# EAGLE schematic STM32F413CG_WM8731 (EAGLE 9.2.0)

## Sheet 1 of 3
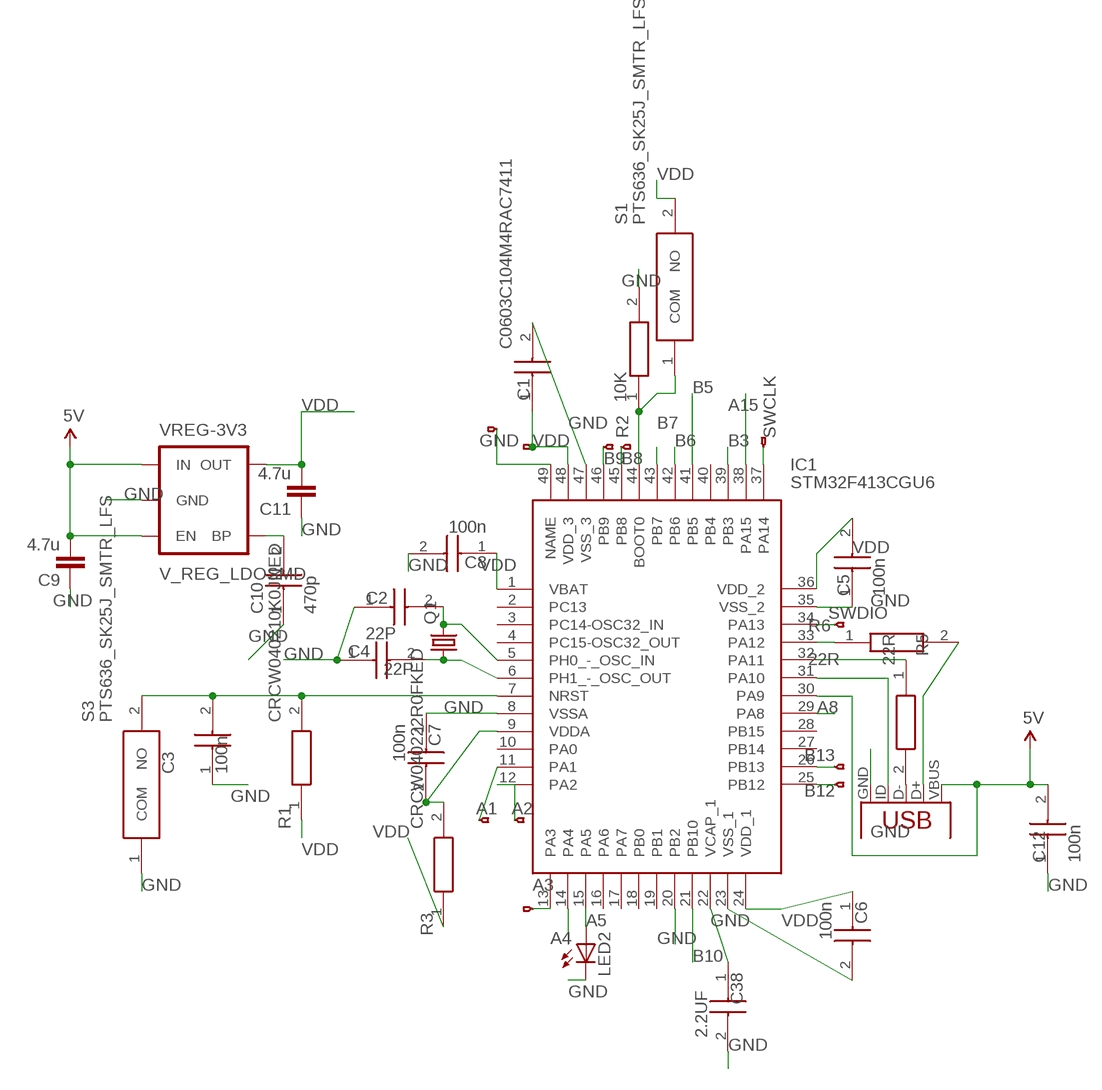
[diagram p0: schematic, sheet 1]

### Parts
C1  C0603C104M4RAC7411  [CAPC1608X95N]
C2  22P  C1608C0G1H150J080AA  [CAPC1608X80N]
C3  100n  C0603C104M4RAC7411  [CAPC1608X95N]
C4  22P  C1608C0G1H150J080AA  [CAPC1608X80N]
C5  100n  C0603C104M4RAC7411  [CAPC1608X95N]
C6  100n  C0603C104M4RAC7411  [CAPC1608X95N]
C7  100n  C0603C104M4RAC7411  [CAPC1608X95N]
C8  100n  C0603C104M4RAC7411  [CAPC1608X95N]
C9  4.7u  C2,5-3  [C2.5-3]
C10  470p  C0603C471K3RACTU  [CAPC1608X87N]
C11  4.7u  C2,5-3  [C2.5-3]
C12  100n  C0603C104M4RAC7411  [CAPC1608X95N]
C38  2.2UF  C2012X7R1E225K125AB  [CAPC2012X145N]
IC1  STM32F413CGU6  [QFN50P700X700X60-49N]
JP1  HEADERHOLE-HEADERHOLE  [1X1-HEADER-HOLE]
JP2  HEADERHOLE-HEADERHOLE  [1X1-HEADER-HOLE]
JP3  HEADERHOLE-HEADERHOLE  [1X1-HEADER-HOLE]
JP4  HEADERHOLE-HEADERHOLE  [1X1-HEADER-HOLE]
JP5  HEADERHOLE-HEADERHOLE  [1X1-HEADER-HOLE]
JP6  HEADERHOLE-HEADERHOLE  [1X1-HEADER-HOLE]
JP7  HEADERHOLE-HEADERHOLE  [1X1-HEADER-HOLE]
JP8  HEADERHOLE-HEADERHOLE  [1X1-HEADER-HOLE]
JP9  HEADERHOLE-HEADERHOLE  [1X1-HEADER-HOLE]
JP10  HEADERHOLE-HEADERHOLE  [1X1-HEADER-HOLE]
JP11  HEADERHOLE-HEADERHOLE  [1X1-HEADER-HOLE]
LED2  LED0603  [LED-0603]
Q1  CRYSTALHC49S  [HC49/S]
R1  CRCW040210K0JNED  [RESC1005X40N]
R2  10K  CRCW040210K0JNED  [RESC1005X40N]
R3  CRCW040222R0FKED  [RESC1005X40N]
R5  22R  CRCW040222R0FKED  [RESC1005X40N]
R6  22R  CRCW040222R0FKED  [RESC1005X40N]
S1  PTS636_SK25J_SMTR_LFS  [PTS636SK25JSMTRLFS]
S3  PTS636_SK25J_SMTR_LFS  [PTS636SK25JSMTRLFS]
VREG-3V3  V_REG_LDOSMD  [SOT23-5]
X1  USB-MICROB-SMD  [USB-MICROB-SMD]

### Nets
5V: C9.2 C12.2 IC1.30(PA9) VREG-3V3.1(IN) VREG-3V3.3(EN) X1.VBUS
A1: IC1.11(PA1) JP8.1
A2: IC1.12(PA2) JP9.1
A3: IC1.13(PA3) JP10.1
A4: IC1.14(PA4) ; also sheet 2
A5: IC1.15(PA5) LED2.A
A8: IC1.29(PA8) ; also sheet 2
A15: IC1.38(PA15) ; also sheet 3
B3: IC1.39(PB3) ; also sheet 3
B5: IC1.41(PB5) ; also sheet 3
B6: IC1.42(PB6) ; also sheet 3
B7: IC1.43(PB7) ; also sheet 3
B8: IC1.45(PB8) JP5.1
B9: IC1.46(PB9) JP11.1
B10: IC1.21(PB10) ; also sheet 3
B12: IC1.25(PB12) JP7.1
B13: IC1.26(PB13) JP6.1
GND: C1.2 C2.1 C3.1 C4.1 C5.1 C6.2 C7.1 C8.2 C9.1 C10.1 C11.1 C12.1 C38.2 IC1.8(VSSA) IC1.20(PB2) IC1.23(VSS_1) IC1.35(VSS_2) IC1.47(VSS_3) IC1.49(NAME) JP1.1 LED2.C R2.2 S3.1(COM) VREG-3V3.2(GND) X1.GND ; also sheet 2,3
N$1: C2.2 IC1.5(PH0_-_OSC_IN) Q1.2
N$3: C3.2 IC1.7(NRST) R1.2 S3.2(NO)
N$4: C10.2 VREG-3V3.4(BP)
N$5: C7.2 IC1.9(VDDA) R3.2
N$7: R5.2 X1.D-
N$8: IC1.31(PA10) X1.ID
N$9: IC1.32(PA11) R5.1
N$10: R6.2 X1.D+
N$11: IC1.33(PA12) R6.1
N$13: IC1.44(BOOT0) R2.1 S1.1(COM)
N$19: C4.2 IC1.6(PH1_-_OSC_OUT) Q1.1
N$48: C38.1 IC1.22(VCAP_1)
SWCLK: IC1.37(PA14) JP2.1
SWDIO: IC1.34(PA13) JP3.1
VDD: C1.1 C5.2 C6.1 C8.1 C11.2 IC1.1(VBAT) IC1.24(VDD_1) IC1.36(VDD_2) IC1.48(VDD_3) JP4.1 R1.1 R3.1 S1.2(NO) VREG-3V3.5(OUT) ; also sheet 2,3
Unconnected: IC1.2(PC13) IC1.3(PC14-OSC32_IN) IC1.4(PC15-OSC32_OUT) IC1.10(PA0) IC1.16(PA6) IC1.17(PA7) IC1.18(PB0) IC1.19(PB1) IC1.27(PB14) IC1.28(PB15) IC1.40(PB4) X1.MT1 X1.MT2 X1.MT3 X1.MT4

## Sheet 2 of 3
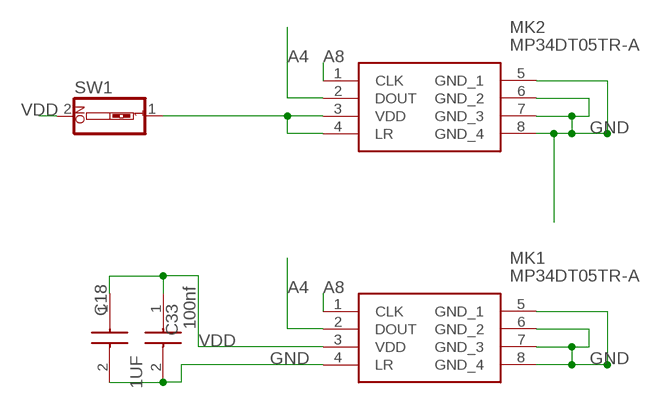
[diagram p1: schematic, sheet 2]

### Parts
C18  1UF  CC0402KRX5R6BB105  [CAPC1005X55N]
C33  100nf  C0603C104M4RAC7411  [CAPC1608X95N]
MK1  MP34DT05TR-A  [MP34DT05TRA]
MK2  MP34DT05TR-A  [MP34DT05TRA]
SW1  SW_DIP-1  [EDG-01]

### Nets
A4: MK1.2(DOUT) MK2.2(DOUT) ; also sheet 1
A8: MK1.1(CLK) MK2.1(CLK) ; also sheet 1
GND: C18.2(C2) C33.2 MK1.4(LR) MK1.5(GND_1) MK1.6(GND_2) MK1.7(GND_3) MK1.8(GND_4) MK2.5(GND_1) MK2.6(GND_2) MK2.7(GND_3) MK2.8(GND_4) ; also sheet 1,3
N$2: MK2.3(VDD) MK2.4(LR) SW1.1
VDD: C18.1(C1) C33.1 MK1.3(VDD) SW1.2 ; also sheet 1,3

## Sheet 3 of 3
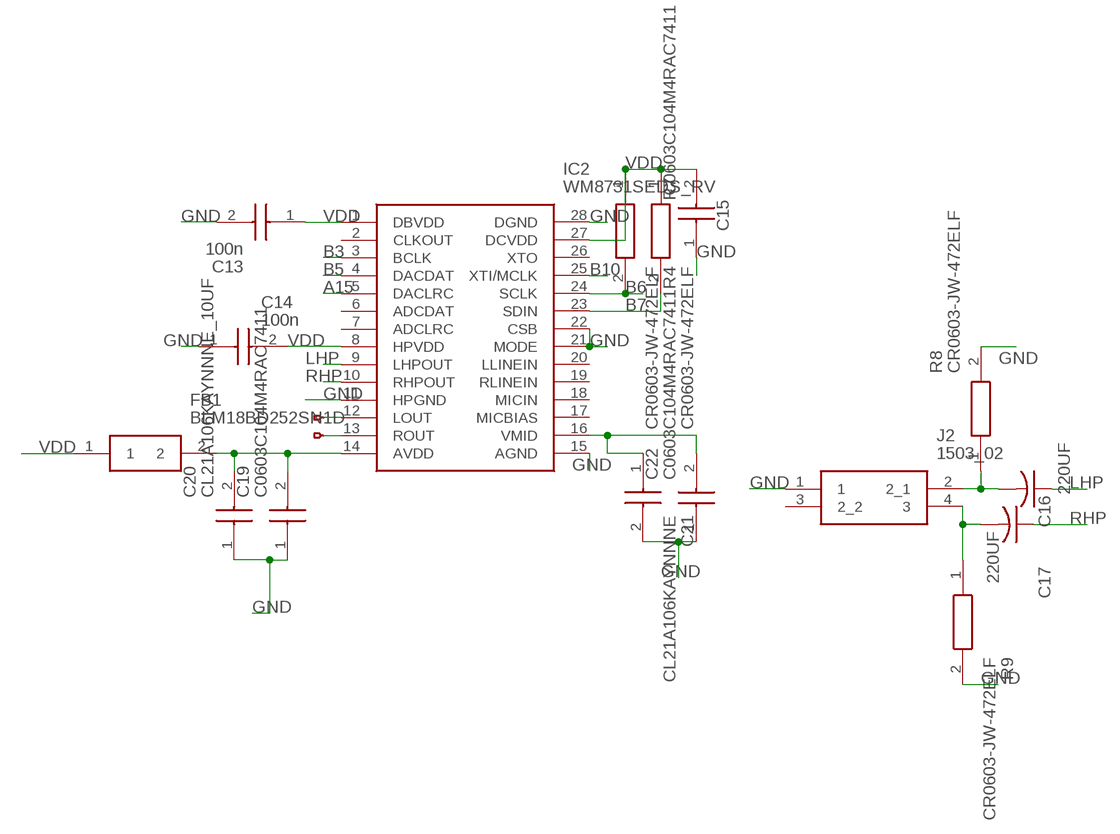
[diagram p2: schematic, sheet 3]

### Parts
C13  100n  C0603C104M4RAC7411  [CAPC1608X95N]
C14  100n  C0603C104M4RAC7411  [CAPC1608X95N]
C15  C0603C104M4RAC7411  [CAPC1608X95N]
C16  220UF  C-US025-024X044  [C025-024X044]
C17  220UF  C-US025-024X044  [C025-024X044]
C19  C0603C104M4RAC7411  [CAPC1608X95N]
C20  CL21A106KAYNNNE_10UF  CL21A106KAYNNNE  [CAPC2012X145N]
C21  CL21A106KAYNNNE  [CAPC2012X145N]
C22  C0603C104M4RAC7411  [CAPC1608X95N]
FB1  BLM18BD252SN1D  [BEADC1608X95N]
IC2  WM8731SEDS_RV  [SOP65P780X200-28N]
J2  1503_02  [150302]
JP12  HEADERHOLE-HEADERHOLE  [1X1-HEADER-HOLE]
JP13  HEADERHOLE-HEADERHOLE  [1X1-HEADER-HOLE]
R4  CR0603-JW-472ELF  [RESC1608X55N]
R7  CR0603-JW-472ELF  [RESC1608X55N]
R8  CR0603-JW-472ELF  [RESC1608X55N]
R9  CR0603-JW-472ELF  [RESC1608X55N]

### Nets
A15: IC2.5(DACLRC) ; also sheet 1
B3: IC2.3(BCLK) ; also sheet 1
B5: IC2.4(DACDAT) ; also sheet 1
B6: IC2.24(SCLK) R4.2 ; also sheet 1
B7: IC2.23(SDIN) R7.2 ; also sheet 1
B10: IC2.25(XTI/MCLK) ; also sheet 1
GND: C13.2 C14.1 C15.1 C19.1 C20.1 C21.2 C22.1 IC2.11(HPGND) IC2.15(AGND) IC2.21(MODE) IC2.22(CSB) IC2.28(DGND) J2.1 R8.2 R9.2 ; also sheet 1,2
LHP: C16.1 IC2.9(LHPOUT)
N$6: C16.2 J2.2(2_1) R8.1
N$12: C19.2 C20.2 FB1.2 IC2.14(AVDD)
N$14: C21.1 C22.2 IC2.16(VMID)
N$15: IC2.12(LOUT) JP13.1
N$16: IC2.13(ROUT) JP12.1
N$25: C17.2 J2.4 R9.1
RHP: C17.1 IC2.10(RHPOUT)
VDD: C13.1 C14.2 C15.2 FB1.1 IC2.1(DBVDD) IC2.8(HPVDD) IC2.27(DCVDD) R4.1 R7.1 ; also sheet 1,2
Unconnected: IC2.2(CLKOUT) IC2.6(ADCDAT) IC2.7(ADCLRC) IC2.17(MICBIAS) IC2.18(MICIN) IC2.19(RLINEIN) IC2.20(LLINEIN) IC2.26(XTO) J2.3(2_2)

## Library data of the parts
C1 C3 C5-C8 C12-C15 C33 = C0603C104M4RAC7411:C0603C104M4RAC7411: KEMET - C0603C104M4RAC7411 - CAP, 0.1F, 16V, 20%, X7R, 0603 Source: Datasheet <https://www.mouser.com/datasheet/2/212/KEM_C1023_X7R_AUTO_SMD-1093309.pdf>; DESCRIPTION: KEMET - C0603C104M4RAC7411 - CAP, 0.1F, 16V, 20%, X7R, 0603; HEIGHT: 0.95mm; MANUFACTURER_NAME: Kemet; MANUFACTURER_PART_NUMBER: C0603C104M4RAC7411; MOUSER_PART_NUMBER: 80-C0603C104M4R7411; MOUSER_PRICE-STOCK: https://www.mouser.com/Search/Refine.aspx?Keyword=80-C0603C104M4R7411
C2 C4 = C1608C0G1H150J080AA_15pF:C1608C0G1H150J080AA: TDK 0603 C 15pF Ceramic Multilayer Capacitor, 50 V dc, +125C, C0G Dielectric, +/-5% SMD Source: Datasheet <https://product.tdk.com/info/en/catalog/datasheets/mlcc_commercial_midvoltage_en.pdf>; DESCRIPTION: TDK 0603 C 15pF Ceramic Multilayer Capacitor, 50 V dc, +125C, C0G Dielectric, +/-5% SMD; HEIGHT: 0.8mm; MANUFACTURER_NAME: TDK; MANUFACTURER_PART_NUMBER: C1608C0G1H150J080AA; MOUSER_PART_NUMBER: 810-C1608C0G1H150J; MOUSER_PRICE-STOCK: https://www.mouser.com/Search/Refine.aspx?Keyword=810-C1608C0G1H150J; RS_PART_NUMBER: 7882935; RS_PRICE-STOCK: https://uk.rs-online.com/web/p/products/7882935
C9 C11 = capacitor-wima:C: CAPACITOR naming: grid - package width
C10 = C0603C471K3RACTU_470pF:C0603C471K3RACTU: KEMET - C0603C471K3RACTU - CAP, X7R, 470PF, 25V, 0603 Source: Datasheet <https://api.kemet.com/component-edge/download/specsheet/C0603C471K3RACTU.pdf>; DESCRIPTION: KEMET - C0603C471K3RACTU - CAP, X7R, 470PF, 25V, 0603; HEIGHT: 0.87mm; MANUFACTURER_NAME: Kemet; MANUFACTURER_PART_NUMBER: C0603C471K3RACTU; MOUSER_PART_NUMBER: 80-C0603C471K3R; MOUSER_PRICE-STOCK: https://www.mouser.com/Search/Refine.aspx?Keyword=80-C0603C471K3R
C16 C17 = rcl:C-US: CAPACITOR, American symbol; SPICEPREFIX: C
C18 = CC0402KRX5R6BB105_1UF:CC0402KRX5R6BB105: CAPACITOR, 0402 1uF +/-10% 10V Source: Datasheet <http://componentsearchengine.com/Datasheets/1/CC0402KRX5R6BB105.pdf>; DESCRIPTION: CAPACITOR, 0402 1uF +/-10% 10V; HEIGHT: mm; MANUFACTURER_NAME: YAGEO (PHYCOMP); MANUFACTURER_PART_NUMBER: CC0402KRX5R6BB105; MOUSER_PART_NUMBER: 603-CC402KRX5R6BB105; MOUSER_PRICE-STOCK: https://www.mouser.com/Search/Refine.aspx?Keyword=603-CC402KRX5R6BB105
C19 C22 = C0603C104M4RAC7411_100nF:C0603C104M4RAC7411: KEMET - C0603C104M4RAC7411 - CAP, 0.1F, 16V, 20%, X7R, 0603 Source: Datasheet <https://www.mouser.com/datasheet/2/212/KEM_C1023_X7R_AUTO_SMD-1093309.pdf>; DESCRIPTION: KEMET - C0603C104M4RAC7411 - CAP, 0.1F, 16V, 20%, X7R, 0603; HEIGHT: 0.95mm; MANUFACTURER_NAME: Kemet; MANUFACTURER_PART_NUMBER: C0603C104M4RAC7411; MOUSER_PART_NUMBER: 80-C0603C104M4R7411; MOUSER_PRICE-STOCK: https://www.mouser.com/Search/Refine.aspx?Keyword=80-C0603C104M4R7411
C20 C21 = CL21A106KAYNNNE_10uF:CL21A106KAYNNNE: Samsung Source: Datasheet <http://www.samsungsem.com/kr/support/library/product-catalog/__icsFiles/afieldfile/2017/09/13/MLCC.pdf>; DESCRIPTION: Samsung; HEIGHT: 1.45mm; MANUFACTURER_NAME: Samsung Electro-Mechanics; MANUFACTURER_PART_NUMBER: CL21A106KAYNNNE; MOUSER_PART_NUMBER: N/A; MOUSER_PRICE-STOCK: https://www.mouser.com/Search/Refine.aspx?Keyword=N%2FA
C38 = C2012X7R1E225K125AB:C2012X7R1E225K125AB: TDK - C2012X7R1E225K125AB - CAPACITOR, MLCC, X7R, 2.2UF, 25V, 0805 Source: Datasheet <https://product.tdk.com/info/en/catalog/datasheets/mlcc_commercial_midvoltage_en.pdf>; DESCRIPTION: TDK - C2012X7R1E225K125AB - CAPACITOR, MLCC, X7R, 2.2UF, 25V, 0805; HEIGHT: 1.45mm; MANUFACTURER_NAME: TDK; MANUFACTURER_PART_NUMBER: C2012X7R1E225K125AB; MOUSER_PART_NUMBER: 810-C2012X7R1E225K; MOUSER_PRICE-STOCK: https://www.mouser.com/Search/Refine.aspx?Keyword=810-C2012X7R1E225K; RS_PART_NUMBER: 9159394P; RS_PRICE-STOCK: http://uk.rs-online.com/web/p/products/9159394P
FB1 = BLM18BD252SN1D_Ferrite Bead:BLM18BD252SN1D: 0603 Ferrite Bead,2K5,25%,50mA,1R5 Murata Ferrite Bead (Chip Ferrite Bead), 1.6 x 0.8 x 0.8mm (0603), 2500 impedance at 100 MHz Source: Datasheet <http://www.murata.com/~/media/webrenewal/support/library/catalog/products/emc/emifil/c31e.ashx?la=en-gb>; DESCRIPTION: 0603 Ferrite Bead,2K5,25%,50mA,1R5 Murata Ferrite Bead (Chip Ferrite Bead), 1.6 x 0.8 x 0.8mm (0603), 2500 impedance at 100 MHz; HEIGHT: 0.95mm; MANUFACTURER_NAME: Murata Electronics; MANUFACTURER_PART_NUMBER: BLM18BD252SN1D; MOUSER_PART_NUMBER: 81-BLM18BD252SN1D; MOUSER_PRICE-STOCK: https://www.mouser.com/Search/Refine.aspx?Keyword=81-BLM18BD252SN1D; RS_PART_NUMBER: 7241321P; RS_PRICE-STOCK: http://uk.rs-online.com/web/p/products/7241321P
IC1 = STM32F413CG_edited:STM32F413CGU6: STMICROELECTRONICS - STM32F413CGU6 - MCU, ARM CORTEX-M4, 100MHZ, UFQFPN-48 Source: Datasheet <http://www.st.com/content/ccc/resource/technical/document/datasheet/group3/f6/1d/4a/d9/f9/96/43/2a/DM00282249/files/DM00282249.pdf/jcr:content/translations/en.DM00282249.pdf>; DESCRIPTION: STMICROELECTRONICS - STM32F413CGU6 - MCU, ARM CORTEX-M4, 100MHZ, UFQFPN-48; HEIGHT: 0.6mm; MANUFACTURER_NAME: STMicroelectronics; MANUFACTURER_PART_NUMBER: STM32F413CGU6; MOUSER_PART_NUMBER: 511-STM32F413CGU6; MOUSER_PRICE-STOCK: https://www.mouser.com/Search/Refine.aspx?Keyword=511-STM32F413CGU6
IC2 = WM8731SEDS_RV_1:WM8731SEDS_RV: WOLFSON MICROELECTRONICS - WM8731SEDS/RV - DAC, AUDIO, 24BIT, HEADPHONE, 28SSOP Source: Datasheet <https://d3uzseaevmutz1.cloudfront.net/pubs/proDatasheet/WM8731_v4.9.pdf>; DESCRIPTION: WOLFSON MICROELECTRONICS - WM8731SEDS/RV - DAC, AUDIO, 24BIT, HEADPHONE, 28SSOP; HEIGHT: 2mm; MANUFACTURER_NAME: WOLFSON MICROELECTRONICS; MANUFACTURER_PART_NUMBER: WM8731SEDS/RV
J2 = 1503_02:1503_02: LUMBERG - 1503 02 - CONNECTOR, RECEPTACLE, 3.5MM PHONO, 3WAY Source: Datasheet <http://www.farnell.com/datasheets/2047485.pdf>; DESCRIPTION: LUMBERG - 1503 02 - CONNECTOR, RECEPTACLE, 3.5MM PHONO, 3WAY; HEIGHT: 5mm; MANUFACTURER_NAME: LUMBERG; MANUFACTURER_PART_NUMBER: 1503 02
JP1-JP13 = F405Pill:HEADERHOLE
LED2 = F405Pill:LED: LEDs Standard schematic elements and footprints for 5mm, 3mm, 1206, and 0603 sized LEDs. 5mm - Spark Fun Electronics SKU : COM-00529 (and others)
MK1 MK2 = MP34DT05TR-A:MP34DT05TR-A: STMICROELECTRONICS - MP34DT05TR-A - MEMS MICROPHONE, 3.6V, HCLGA-4 Source: Datasheet <http://www.st.com/content/ccc/resource/technical/document/datasheet/group3/c7/90/d3/f6/b7/e7/40/c8/DM00415595/files/DM00415595.pdf/jcr:content/translations/en.DM00415595.pdf>; DESCRIPTION: STMICROELECTRONICS - MP34DT05TR-A - MEMS MICROPHONE, 3.6V, HCLGA-4; HEIGHT: 1mm; MANUFACTURER_NAME: STMicroelectronics; MANUFACTURER_PART_NUMBER: MP34DT05TR-A; MOUSER_PART_NUMBER: 511-MP34DT05TR-A; MOUSER_PRICE-STOCK: https://www.mouser.com/Search/Refine.aspx?Keyword=511-MP34DT05TR-A
Q1 = crystal:CRYSTAL: CRYSTAL; OC_FARNELL: 1667008; OC_NEWARK: unknown
R1 R2 = CRCW040210K0JNED:CRCW040210K0JNED: Thick Film Resistors - SMD 1/16watt 10Kohms 5% Source: Datasheet <http://www.vishay.com/docs/20035/dcrcwe3.pdf>; ALLIED_NUMBER: 70202522; ALLIED_PRICE-STOCK: https://www.alliedelec.com/vishay-dale-crcw040210k0jned/70202522/; DESCRIPTION: Thick Film Resistors - SMD 1/16watt 10Kohms 5%; HEIGHT: 0.4mm; MANUFACTURER_NAME: Vishay; MANUFACTURER_PART_NUMBER: CRCW040210K0JNED; MOUSER_PART_NUMBER: 71-CRCW0402J-10K-E3; MOUSER_PRICE-STOCK: https://www.mouser.com/Search/Refine.aspx?Keyword=71-CRCW0402J-10K-E3
R3 R5 R6 = CRCW040222R0FKED_22R:CRCW040222R0FKED: Vishay CRCW Series Thick Film Surface Mount Resistor 0402 Case 22 +/-1% 0.063W +/-100ppm/C Source: Datasheet <http://www.vishay.com/docs/20035/dcrcwe3.pdf>; ALLIED_NUMBER: 70202113; ALLIED_PRICE-STOCK: https://www.alliedelec.com/vishay-dale-crcw040222r0fked/70202113/; DESCRIPTION: Vishay CRCW Series Thick Film Surface Mount Resistor 0402 Case 22 +/-1% 0.063W +/-100ppm/C; HEIGHT: 0.4mm; MANUFACTURER_NAME: Vishay; MANUFACTURER_PART_NUMBER: CRCW040222R0FKED; MOUSER_PART_NUMBER: 71-CRCW0402-22-E3; MOUSER_PRICE-STOCK: https://www.mouser.com/Search/Refine.aspx?Keyword=71-CRCW0402-22-E3; RS_PART_NUMBER: 6788983P; RS_PRICE-STOCK: http://uk.rs-online.com/web/p/products/6788983P
R4 R7-R9 = CR0603-JW-472ELF:CR0603-JW-472ELF: BOURNS - CR0603-JW-472ELF - RES, THICK FILM, 4K7, 5%, 0.1W, 0603, REEL Source: Datasheet <https://www.bourns.com/pdfs/chpreztr.pdf>; ALLIED_NUMBER: 70154691; ALLIED_PRICE-STOCK: https://www.alliedelec.com/bourns-cr0603-jw-472elf/70154691/; DESCRIPTION: BOURNS - CR0603-JW-472ELF - RES, THICK FILM, 4K7, 5%, 0.1W, 0603, REEL; HEIGHT: 0.55mm; MANUFACTURER_NAME: Bourns; MANUFACTURER_PART_NUMBER: CR0603-JW-472ELF; MOUSER_PART_NUMBER: 652-CR0603-JW-472ELF; MOUSER_PRICE-STOCK: https://www.mouser.com/Search/Refine.aspx?Keyword=652-CR0603-JW-472ELF; RS_PART_NUMBER: 7408956P; RS_PRICE-STOCK: http://uk.rs-online.com/web/p/products/7408956P
S1 S3 = PTS636_SK25J_SMTR_LFS_tactSwitch6x3x2:PTS636_SK25J_SMTR_LFS: Tactile Switches Tact 50mA 12VDC, 6.0x3.5, 2.5mm H, 250gf, J leads, No ground pin, Red Actuator Source: Datasheet <https://www.mouser.com/datasheet/2/60/pts636-1550567.pdf>; DESCRIPTION: Tactile Switches Tact 50mA 12VDC, 6.0x3.5, 2.5mm H, 250gf, J leads, No ground pin, Red Actuator; HEIGHT: 2.7mm; MANUFACTURER_NAME: C & K COMPONENTS; MANUFACTURER_PART_NUMBER: PTS636 SK25J SMTR LFS; MOUSER_PART_NUMBER: 611-PTS636SK25JSMTRL; MOUSER_PRICE-STOCK: https://www.mouser.com/Search/Refine.aspx?Keyword=611-PTS636SK25JSMTRL
SW1 = special:SW_DIP-1: DIP SWITCH
VREG-3V3 = F405Pill:V_REG_LDO: Voltage Regulator LDO Standard 150mA LDO voltage regulator in SOT-23 layout. Micrel part MIC5205. BP (by-pass) pin is used to lower output noise with 470pF cap.
X1 = F405Pill:USB: USB Connectors USB-B-PTH is fully proven SKU : PRT-00139 USB-miniB is fully proven SKU : PRT-00587 USB-A-PCB is untested. USB-A-H is throughly reviewed, but untested. Spark Fun Electronics SKU : PRT-00437 USB-B-SMT is throughly reviewed, but untested. Needs silkscreen touching up. USB-A-S has not been used/tested USB-MB-H has not been used/tested

## Net classes
0 default: width 0.254 mm, drill 0.35 mm